# EAGLE design mainboard (EAGLE 9.6.2)
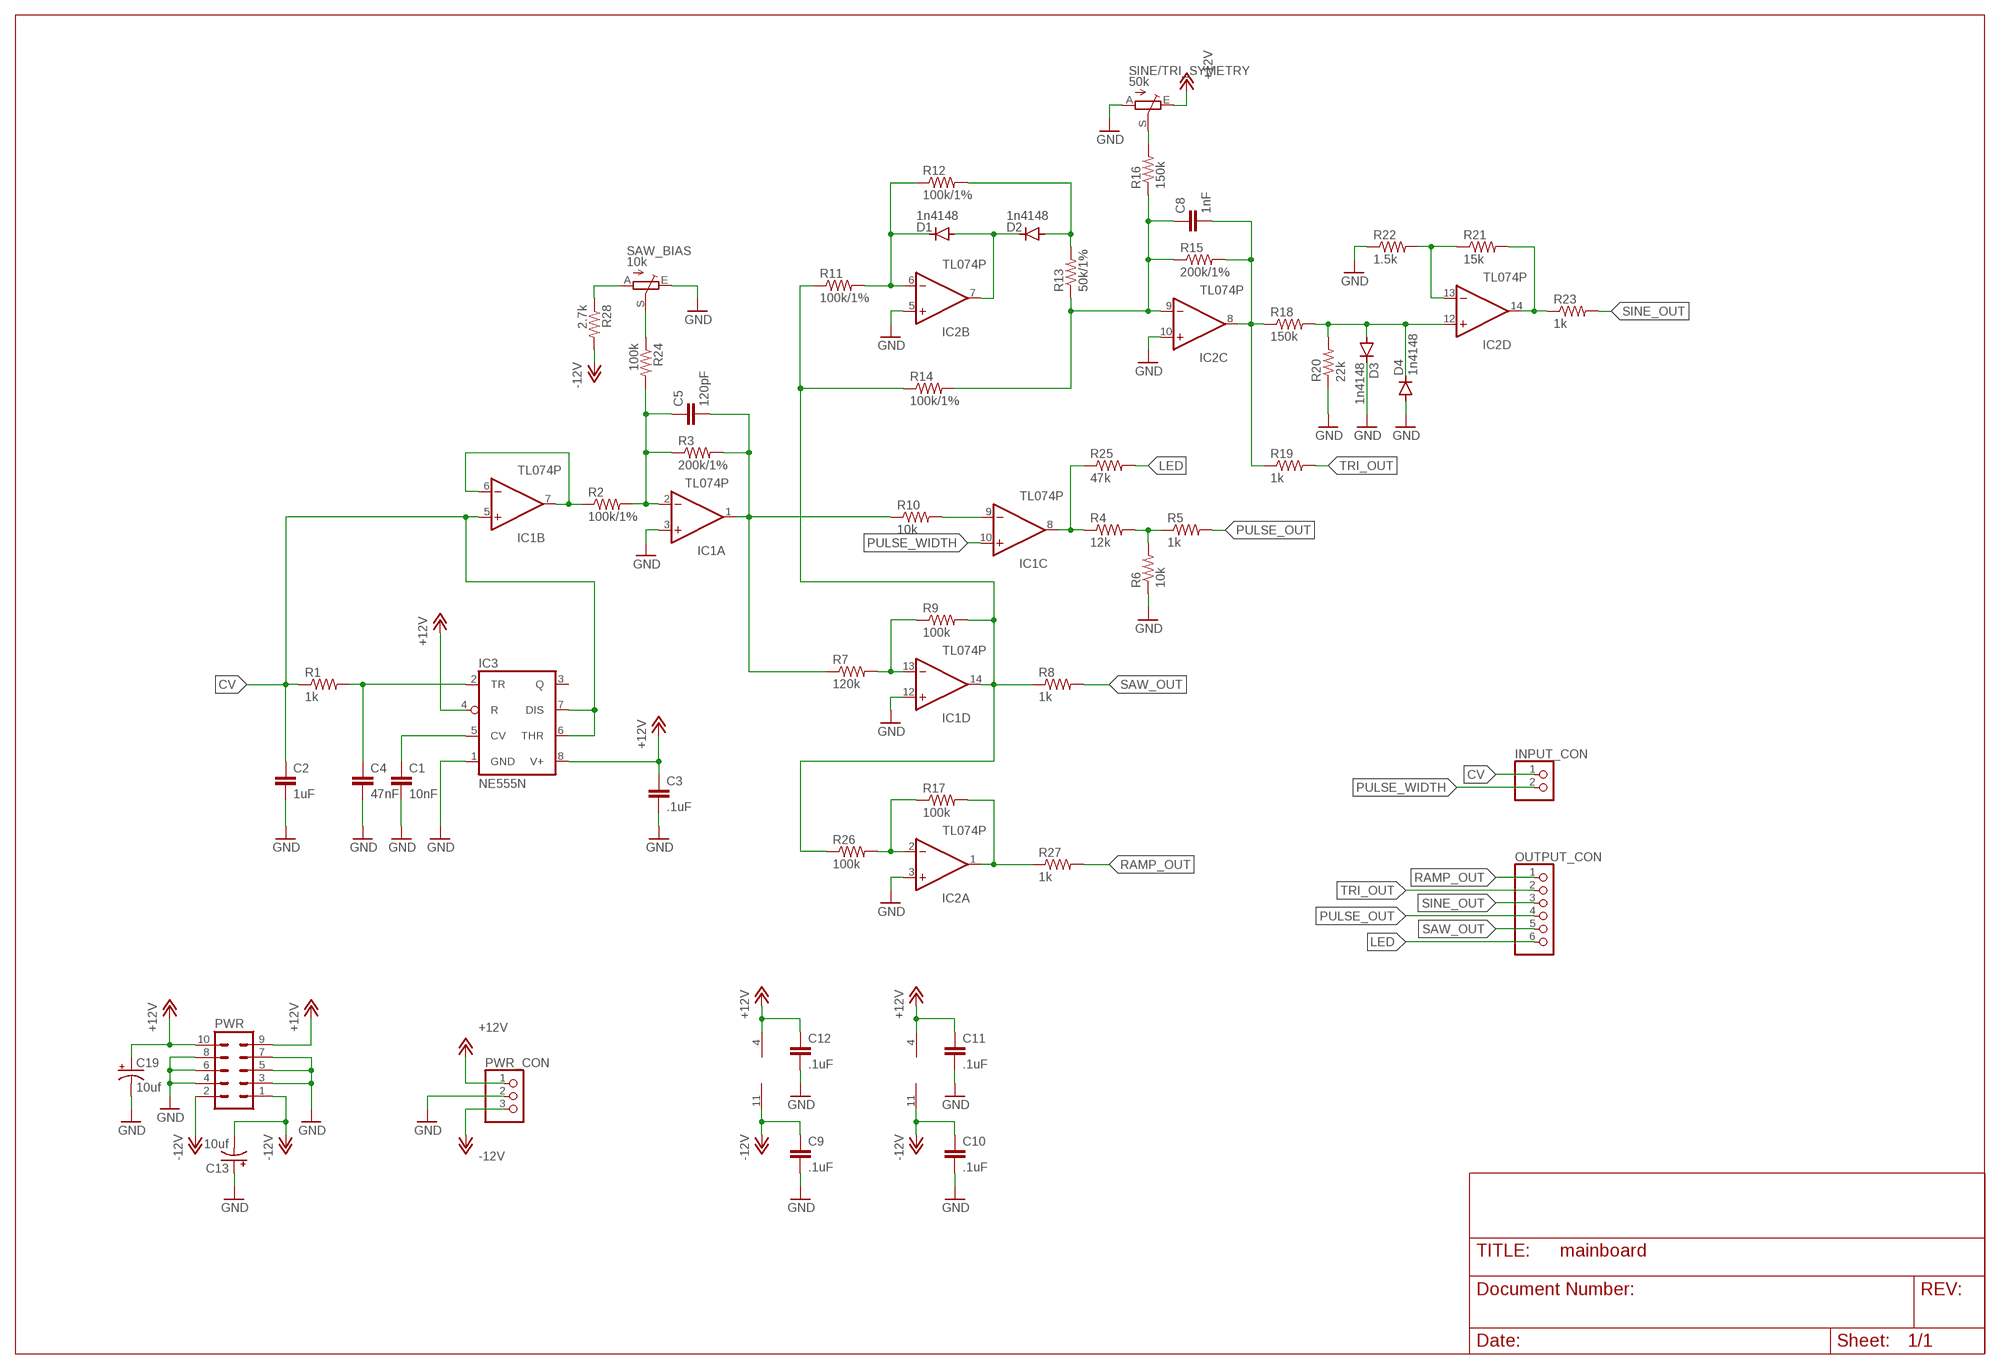
[diagram p0: schematic, sheet 1]

## Parts
C1  10nF  C-EU050-024X044  [C050-024X044]
C2  1uF  C-EU075-032X103  [C075-032X103]
C3  .1uF  C-EU050-024X044  [C050-024X044]
C4  47nF  C-EU050-024X044  [C050-024X044]
C5  120pF  C-EU050-024X044  [C050-024X044]
C8  1nF  C-EU050-024X044  [C050-024X044]
C9  .1uF  C-EU050-024X044  [C050-024X044]
C10  .1uF  C-EU050-024X044  [C050-024X044]
C11  .1uF  C-EU050-024X044  [C050-024X044]
C12  .1uF  C-EU050-024X044  [C050-024X044]
C13  10uf  CPOL-USE2.5-5  [E2,5-5]
C19  10uf  CPOL-USE2.5-5  [E2,5-5]
D1  1n4148  1N4148DO35-7  [DO35-7]
D2  1n4148  1N4148DO35-7  [DO35-7]
D3  1n4148  1N4148DO35-7  [DO35-7]
D4  1n4148  1N4148DO35-7  [DO35-7]
IC1  TL074P  [DIL14]
IC2  TL074P  [DIL14]
IC3  NE555N  [DIL08]
INPUT_CON  PINHD-1X2  [1X02]
OUTPUT_CON  PINHD-1X6  [1X06]
PWR  ML10  [ML10]
PWR_CON  PINHD-1X3  [1X03]
R1  1k  R-US_0207/7  [0207/7]
R2  100k/1%  R-US_0207/7  [0207/7]
R3  200k/1%  R-US_0207/7  [0207/7]
R4  12k  R-US_0207/7  [0207/7]
R5  1k  R-US_0207/7  [0207/7]
R6  10k  R-US_0207/7  [0207/7]
R7  120k  R-US_0207/7  [0207/7]
R8  1k  R-US_0207/7  [0207/7]
R9  100k  R-US_0207/7  [0207/7]
R10  10k  R-US_0207/7  [0207/7]
R11  100k/1%  R-US_0207/7  [0207/7]
R12  100k/1%  R-US_0207/7  [0207/7]
R13  50k/1%  R-US_0207/7  [0207/7]
R14  100k/1%  R-US_0207/7  [0207/7]
R15  200k/1%  R-US_0207/7  [0207/7]
R16  150k  R-US_0207/7  [0207/7]
R17  100k  R-US_0207/7  [0207/7]
R18  150k  R-US_0207/7  [0207/7]
R19  1k  R-US_0207/7  [0207/7]
R20  22k  R-US_0207/7  [0207/7]
R21  15k  R-US_0207/7  [0207/7]
R22  1.5k  R-US_0207/7  [0207/7]
R23  1k  R-US_0207/7  [0207/7]
R24  100k  R-US_0207/7  [0207/7]
R25  47k  R-US_0207/7  [0207/7]
R26  100k  R-US_0207/7  [0207/7]
R27  1k  R-US_0207/7  [0207/7]
R28  2.7k  R-US_0207/7  [0207/7]
SAW_BIAS  10k  TRIM_1234-S64YW  [S64YW]
SINE/TRI_SYMETRY  50k  TRIM_1234-S64YW  [S64YW]

## Nets
+12V: C3.1 C11.1 C12.1 C19.+ IC1.4(P:V+) IC2.4(P:V+) IC3.4(R) IC3.8(V+) PWR.9 PWR.10 PWR_CON.1 SINE/TRI_SYMETRY.E
-12V: C9.1 C10.1 C13.- IC1.11(P:V-) IC2.11(P:V-) PWR.1 PWR.2 PWR_CON.3 R28.2
CV: C2.1 IC1.5(B:+IN) IC3.6(THR) IC3.7(DIS) INPUT_CON.1 R1.1
GND: C1.2 C2.2 C3.2 C4.2 C9.2 C10.2 C11.2 C12.2 C13.+ C19.- D3.C D4.A IC1.3(A:+IN) IC1.12(D:+IN) IC2.3(A:+IN) IC2.5(B:+IN) IC2.10(C:+IN) IC3.1(GND) PWR.3 PWR.4 PWR.5 PWR.6 PWR.7 PWR.8 PWR_CON.2 R6.1 R20.1 R22.1 SAW_BIAS.E SINE/TRI_SYMETRY.A
LED: OUTPUT_CON.6 R25.2
LED_OUT: IC1.8(C:OUT) R4.1 R25.1
N$1: C1.1 IC3.5(CV)
N$2: C4.1 IC3.2(TR) R1.2
N$3: IC1.6(B:-IN) IC1.7(B:OUT) R2.1
N$4: C5.1 IC1.2(A:-IN) R2.2 R3.1 R24.2
N$5: IC2.2(A:-IN) R17.1 R26.2
N$6: R4.2 R5.1 R6.2
N$7: R24.1 SAW_BIAS.S
N$8: C5.2 IC1.1(A:OUT) R3.2 R7.1 R10.1
N$9: IC1.13(D:-IN) R7.2 R9.1
N$10: R28.1 SAW_BIAS.A
N$11: IC1.9(C:-IN) R10.2
N$12: D1.C IC2.6(B:-IN) R11.2 R12.1
N$13: C8.1 IC2.9(C:-IN) R13.1 R14.2 R15.1 R16.1
N$14: D1.A D2.C IC2.7(B:OUT)
N$15: D2.A R12.2 R13.2
N$16: R16.2 SINE/TRI_SYMETRY.S
N$17: C8.2 IC2.8(C:OUT) R15.2 R18.1 R19.1
N$18: D3.A D4.C IC2.12(D:+IN) R18.2 R20.2
N$19: IC2.14(D:OUT) R21.2 R23.1
N$20: IC2.13(D:-IN) R21.1 R22.2
N$21: IC1.14(D:OUT) R8.1 R9.2 R11.1 R14.1 R26.1
N$23: IC2.1(A:OUT) R17.2 R27.1
PULSE_OUT: OUTPUT_CON.4 R5.2
PULSE_WIDTH: IC1.10(C:+IN) INPUT_CON.2
RAMP_OUT: OUTPUT_CON.1 R27.2
SAW_OUT: OUTPUT_CON.5 R8.2
SINE_OUT: OUTPUT_CON.3 R23.2
TRI_OUT: OUTPUT_CON.2 R19.2
Unconnected: IC3.3(Q) SAW_BIAS.S@1(S) SINE/TRI_SYMETRY.S@1(S)

## Library data of the parts
C1-C5 C8-C12 = rcl:C-EU: CAPACITOR, European symbol; SPICEPREFIX: C
C13 C19 = resistor:CPOL-US: POLARIZED CAPACITOR, American symbol
D1-D4 = diode:1N4148: DIODE high speed (Philips)
IC1 IC2 = linear:TL074: OP AMP
IC3 = linear:*555: TIMER
INPUT_CON = pinhead:PINHD-1X2: PIN HEADER
OUTPUT_CON = pinhead:PINHD-1X6: PIN HEADER
PWR = con-ml:ML10: HARTING; OC_FARNELL: unknown; OC_NEWARK: unknown
PWR_CON = pinhead:PINHD-1X3: PIN HEADER
R1-R28 = rcl:R-US_: RESISTOR, American symbol; SPICEPREFIX: R
SAW_BIAS SINE/TRI_SYMETRY = pot:TRIM_1234-: POTENTIOMETER

## Board
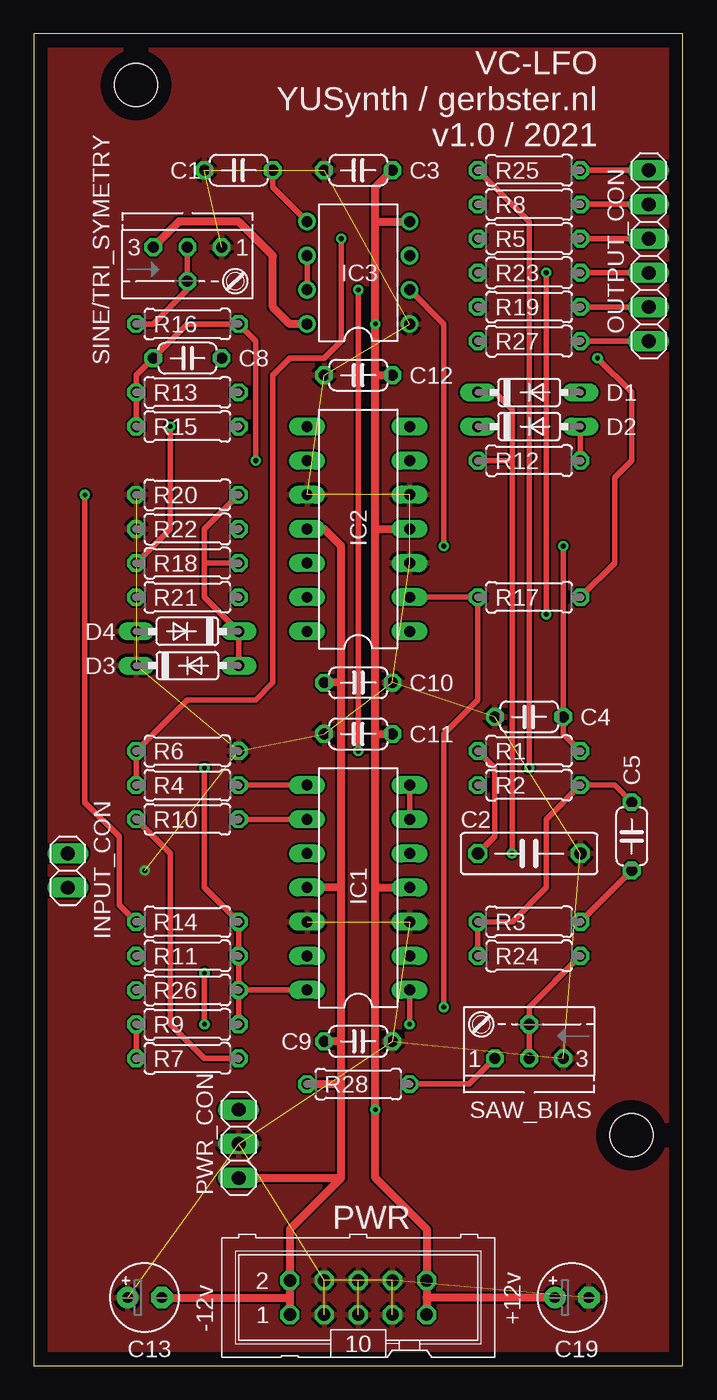
[diagram p1: board, top side]
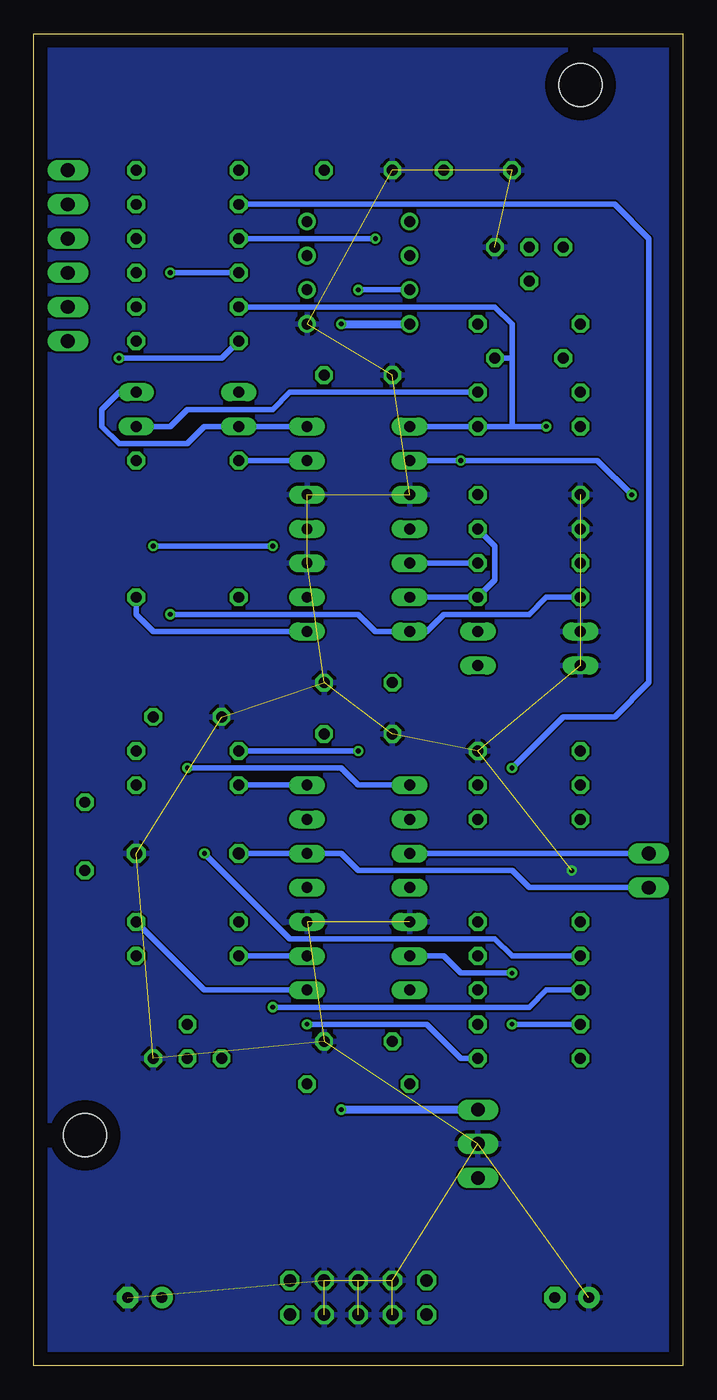
[diagram p2: board, bottom side, seen from below]

Size 48.26 x 99.06 mm. Coordinates in mm from the lower left corner, seen from the top.
Outline: 0,0 48.26,0 48.26,99.06 0,99.06 0,0
Copper layers (1*16): Top 0.035mm / dielectric 1.5mm / Bottom 0.035mm
Design rules "default": minimum track width 6mil, minimum drill 0.35mm, track to track 6mil, track to pad 6mil, pad to pad 6mil, via to via 6mil, smd to smd 6mil, copper to edge 40mil, drill to drill 6mil, minimum pad ring 10mil, minimum via ring 8mil, stop-mask expansion 4mil, vias tented up to drill 0mil, thermal gap 10mil
Holes 3.2 mm at 44.45,17.14 7.62,95.25

### Footprints (pad centres in the part's own frame; a part is rotated, then mirrored left to right if it is on the bottom)
C050-024X044 = drill 0.813 octagon: 1 -2.54,0; 2 2.54,0
C075-032X103 = drill 0.914 octagon: 1 -3.81,0; 2 3.81,0
E2,5-5 = drill 0.813 pad 1.6: + -1.27,0 | drill 0.813 pad 1.6 octagon: - 1.27,0
DO35-7 = drill 0.813 long: A 3.81,0; C -3.81,0
DIL14 = drill 0.813 long: 1 -7.62,-3.81; 2 -5.08,-3.81; 3 -2.54,-3.81; 4 0,-3.81; 5 2.54,-3.81; 6 5.08,-3.81; 7 7.62,-3.81; 8 7.62,3.81; 9 5.08,3.81; 10 2.54,3.81; 11 0,3.81; 12 -2.54,3.81; 13 -5.08,3.81; 14 -7.62,3.81
DIL08 = drill 0.813 pad 1.27: 1 -3.81,-3.81; 2 -1.27,-3.81; 3 1.27,-3.81; 4 3.81,-3.81; 5 3.81,3.81; 6 1.27,3.81; 7 -1.27,3.81; 8 -3.81,3.81
1X02 = drill 1.016 long: 1 -1.27,0; 2 1.27,0
1X06 = drill 1.016 long: 1 -6.35,0; 2 -3.81,0; 3 -1.27,0; 4 1.27,0; 5 3.81,0; 6 6.35,0
ML10 = drill 0.914 octagon: 1 -5.08,-1.27; 2 -5.08,1.27; 3 -2.54,-1.27; 4 -2.54,1.27; 5 0,-1.27; 6 0,1.27; 7 2.54,-1.27; 8 2.54,1.27; 9 5.08,-1.27; 10 5.08,1.27
1X03 = drill 1.016 long: 1 -2.54,0; 2 0,0; 3 2.54,0
0207/7 = drill 0.813 octagon: 1 -3.81,0; 2 3.81,0
S64YW = drill 0.813 octagon: A 2.54,1.27; E -2.54,1.27; S 0,-1.27; S@1 0,1.27

### Placement (x,y rotation side)
C1  15.24,88.9 180 top
C2  36.83,38.1 0 top
C3  24.13,88.9 180 top
C4  36.83,48.26 180 top
C5  44.45,39.37 270 top
C8  11.43,74.93 0 top
C9  24.13,24.13 0 top
C10  24.13,50.8 0 top
C11  24.13,46.99 180 top
C12  24.13,73.66 180 top
C13  8.26,5.08 0 top
C19  40.01,5.08 0 top
D1  36.83,72.39 0 top
D2  36.83,69.85 0 top
D3  11.43,52.07 0 top
D4  11.43,54.61 180 top
IC1  24.13,35.56 90 top
IC2  24.13,62.23 90 top
IC3  24.13,81.28 90 top
INPUT_CON  2.54,36.83 90 top
OUTPUT_CON  45.72,82.55 90 top
PWR  24.13,5.08 0 top
PWR_CON  15.24,16.51 270 top
R1  36.83,45.72 0 top
R2  36.83,43.18 0 top
R3  36.83,33.02 0 top
R4  11.43,43.18 180 top
R5  36.83,83.82 0 top
R6  11.43,45.72 180 top
R7  11.43,22.86 180 top
R8  36.83,86.36 0 top
R9  11.43,25.4 0 top
R10  11.43,40.64 0 top
R11  11.43,30.48 180 top
R12  36.83,67.31 0 top
R13  11.43,72.39 0 top
R14  11.43,33.02 180 top
R15  11.43,69.85 0 top
R16  11.43,77.47 180 top
R17  36.83,57.15 0 top
R18  11.43,59.69 0 top
R19  36.83,78.74 0 top
R20  11.43,64.77 0 top
R21  11.43,57.15 180 top
R22  11.43,62.23 0 top
R23  36.83,81.28 0 top
R24  36.83,30.48 180 top
R25  36.83,88.9 0 top
R26  11.43,27.94 180 top
R27  36.83,76.2 0 top
R28  24.13,20.95 180 top
SAW_BIAS  36.83,24.13 180 top
SINE/TRI_SYMETRY  11.43,81.92 0 top

### Tracks (layer width: path | path; a pad name or v marks a point on that pad's centre or on a via)
+12V  (via drill 0.35)
  Top 0.61: 25.4,35.56 v25.4,19.05 25.4,13.97 29.21,10.16 PWR.10 29.21,5.08 | 25.4,35.56 IC1.4 | 25.4,35.56 25.4,46.99 | 25.4,46.99 C11.1 | 25.4,46.99 25.4,62.23 | 25.4,62.23 IC2.4 | 25.4,62.23 25.4,73.66 | 25.4,73.66 C12.1 | 25.4,73.66 v25.4,77.47 25.4,85.09 | 25.4,85.09 IC3.4 | 25.4,85.09 25.4,87.63 C3.1 | IC3.8 19.05,77.47 17.78,78.74 17.78,82.55 15.24,85.09 10.79,85.09 SINE/TRI_SYMETRY.E | 29.21,5.08 PWR.9 | C19.+ 29.21,5.08
  Bottom 0.61: v25.4,77.47 IC3.8 | PWR_CON.1 v25.4,19.05
-12V
  Top 0.61: 22.86,13.97 19.05,10.16 PWR.2 19.05,5.08 | 22.86,13.97 22.86,20.95 | 22.86,20.95 22.86,24.13 | 22.86,24.13 C9.1 | 22.86,24.13 22.86,35.56 | 22.86,35.56 IC1.11 | 22.86,35.56 22.86,50.8 | 22.86,50.8 C10.1 | 22.86,50.8 22.86,60.96 21.59,62.23 IC2.11 | R28.2 22.86,20.95 | PWR_CON.3 22.86,13.97 | 19.05,5.08 PWR.1 | C13.- 19.05,5.08
CV  (via drill 0.35)
  Top 0.406: C2.1 34.29,39.37 34.29,44.45 R1.1 | IC3.6 IC3.7 | v24.13,80.01 v24.13,45.72
  Bottom 0.406: C2.1 IC1.5 25.4,38.1 24.13,36.83 12.7,36.83 11.43,35.56 INPUT_CON.1 | IC3.7 v24.13,80.01 | v24.13,45.72 R1.1
GND  (via drill 0.35)  (30 unrouted)
  other vias: 8.26,36.83
  pour Top: 0,99.06 0,0 48.26,0 48.26,99.06
  pour Bottom: 0,99.06 0,0 48.26,0 48.26,99.06
LED
  Top 0.406: OUTPUT_CON.6 R25.2
LED_OUT  (via drill 0.35)
  Top 0.406: IC1.8 R4.1 | v36.83,44.45 36.83,85.09 R25.1
  Bottom 0.406: IC1.8 24.13,43.18 25.4,44.45 v36.83,44.45
N$1
  Top 0.406: IC3.5 17.78,87.63 C1.1
N$2  (via drill 0.35)
  Top 0.406: R1.2 39.37,46.99 C4.1 v39.37,60.96 | IC3.2 30.48,77.47 v30.48,60.96
  Bottom 0.406: v30.48,60.96 v39.37,60.96
N$3
  Top 0.406: IC1.7 IC1.6
  Bottom 0.406: IC1.7 R2.1
N$4
  Top 0.406: R24.2 R3.1 35.56,33.02 38.1,35.56 38.1,40.64 R2.2 43.18,43.18 C5.1
  Bottom 0.406: IC1.2 R24.2
N$5  (via drill 0.35)
  Top 0.406: IC2.2 R17.1 33.02,49.53 30.48,46.99 v30.48,26.67
  Bottom 0.406: v30.48,26.67 11.43,26.67 10.16,27.94 R26.2
N$6  (via drill 0.35)
  Top 0.406: R4.2 R6.2 11.43,49.53 16.51,49.53 17.78,50.8 17.78,73.66 19.05,74.93 21.59,74.93 22.86,76.2 v22.86,83.82
  Bottom 0.406: v22.86,83.82 R5.1
N$7
  Top 0.406: R24.1 36.83,26.67 SAW_BIAS.S 36.83,22.86
N$8  (via drill 0.35)
  Top 0.406: C5.2 R3.2 | v27.94,25.4 IC1.1 | R7.1 12.7,22.86 10.16,25.4 10.16,38.1 R10.1
  Bottom 0.406: R3.2 35.56,27.94 IC1.1 | R7.1 16.51,22.86 19.05,25.4 v27.94,25.4
N$9  (via drill 0.35)
  Top 0.406: R7.2 R9.1 | v12.7,29.21 v12.7,25.4
  Bottom 0.406: IC1.13 17.78,30.48 16.51,29.21 v12.7,29.21 | v12.7,25.4 R9.1
N$10
  Top 0.406: R28.1 32.38,20.95 SAW_BIAS.A
N$11
  Top 0.406: IC1.9 R10.2
N$12  (via drill 0.35)
  Top 0.406: D1.C 34.29,72.39 35.56,71.12 35.56,67.31 | R12.1 35.56,67.31 | 35.56,67.31 v35.56,38.1
  Bottom 0.406: IC2.6 R12.1 | R11.2 12.7,30.48 13.97,31.75 29.21,31.75 v35.56,38.1
N$13  (via drill 0.35)
  Top 0.406: R15.1 R13.1 7.62,73.66 C8.1 11.43,77.47 R16.1 16.51,76.2 v16.51,67.31 | v3.81,64.77 3.81,41.91 6.35,39.37 6.35,34.29 R14.2
  Bottom 0.406: IC2.9 v16.51,67.31 6.35,67.31 v3.81,64.77
N$14
  Bottom 0.406: IC2.7 D2.C 35.56,69.85 36.83,68.58 41.91,68.58 43.18,69.85 43.18,71.12 41.91,72.39 D1.A
N$15
  Top 0.406: R12.2 D2.A
  Bottom 0.406: R13.2 29.21,72.39 30.48,71.12 36.83,71.12 38.1,69.85 D2.A
N$16
  Top 0.406: R16.2 8.89,77.47 11.43,80.01 SINE/TRI_SYMETRY.S 11.43,83.19
N$17  (via drill 0.35)
  Top 0.406: R18.1 10.16,62.23 v10.16,69.85
  Bottom 0.406: IC2.8 R15.2 12.7,69.85 | C8.2 12.7,74.93 | 12.7,74.93 12.7,69.85 | v10.16,69.85 12.7,69.85 | R19.1 13.97,78.74 12.7,77.47 12.7,74.93
N$18
  Top 0.406: 12.7,59.69 12.7,57.15 D4.C D3.A | R18.2 12.7,59.69 | 12.7,59.69 12.7,62.23 R20.2
  Bottom 0.406: IC2.12 R18.2
N$19  (via drill 0.35)
  Top 0.406: v38.1,55.88 v38.1,81.28
  Bottom 0.406: R21.2 10.16,57.15 11.43,55.88 17.78,55.88 19.05,54.61 IC2.14 22.86,54.61 24.13,55.88 v38.1,55.88 | v38.1,81.28 R23.1
N$20
  Bottom 0.406: IC2.13 R21.1 13.97,58.42 13.97,60.96 R22.2
N$21  (via drill 0.35)
  Top 0.406: IC1.14 R26.1 | R26.1 R11.1 R14.1 12.7,35.56 v12.7,44.45 | R9.2 R26.1
  Bottom 0.406: v12.7,44.45 8.89,48.26 5.08,48.26 2.54,50.8 2.54,83.82 5.08,86.36 R8.1
N$23  (via drill 0.35)
  Top 0.406: v41.91,74.93 44.45,72.39 44.45,67.31 43.18,66.04 43.18,59.69 R17.2
  Bottom 0.406: IC2.1 39.37,54.61 40.64,55.88 R17.2 | R27.1 34.29,74.93 v41.91,74.93
PULSE_OUT
  Top 0.406: OUTPUT_CON.4 R5.2
PULSE_WIDTH
  Bottom 0.406: INPUT_CON.2 IC1.10
RAMP_OUT
  Top 0.406: R27.2 OUTPUT_CON.1
SAW_OUT
  Top 0.406: R8.2 OUTPUT_CON.5
SINE_OUT
  Top 0.406: R23.2 OUTPUT_CON.3
TRI_OUT
  Top 0.406: OUTPUT_CON.2 R19.2

### Text on the board
tNames: VC-LFO / YUSynth / gerbster.nl / v1.0 / 2021 | +12v | -12v